# EAGLE schematic resistor-pull-up-down (EAGLE 9.5.2)
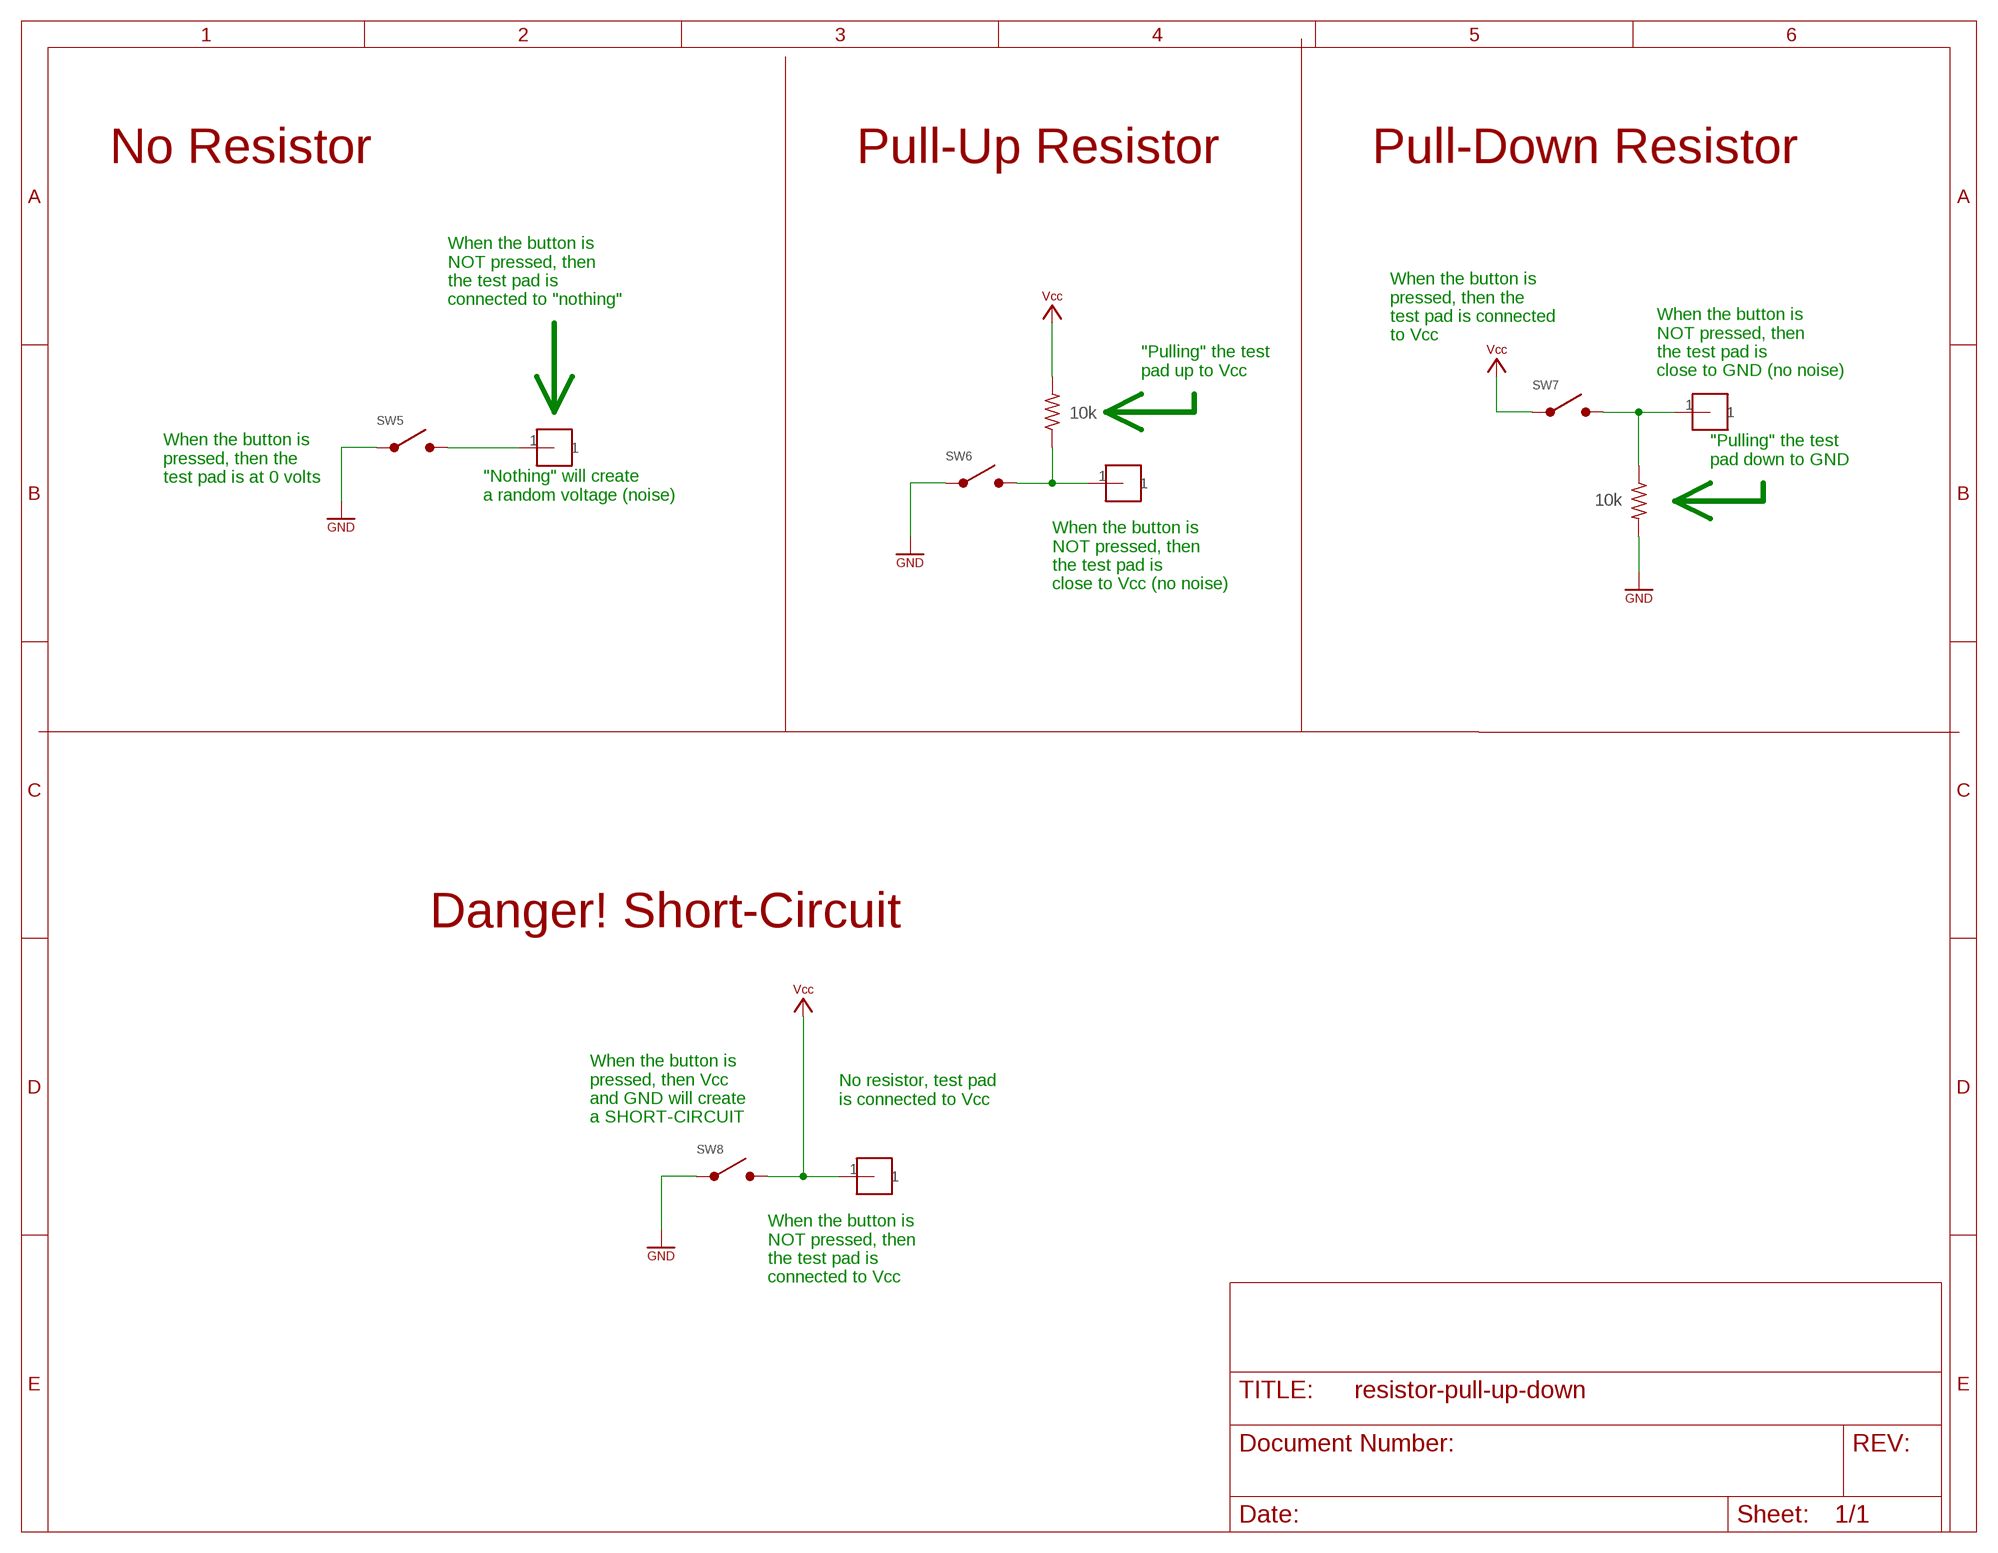
[diagram p0: schematic, sheet 1]

## Parts
R1  10k  R-US_R0603  [R0603]
R2  10k  R-US_R0603  [R0603]
SW5  SWITCH_BUTTON_SPST  [7914G-1-000E]
SW6  SWITCH_BUTTON_SPST  [7914G-1-000E]
SW7  SWITCH_BUTTON_SPST  [7914G-1-000E]
SW8  SWITCH_BUTTON_SPST  [7914G-1-000E]
U$1  HEADER-1-TESTPOINT  [TESTPOINT-1]
U$2  HEADER-1-TESTPOINT  [TESTPOINT-1]
U$3  HEADER-1-TESTPOINT  [TESTPOINT-1]
U$4  HEADER-1-TESTPOINT  [TESTPOINT-1]

## Nets
GND: R2.2 SW5.1A SW5.1B SW6.1A SW6.1B SW8.1A SW8.1B ; supply symbol labelled SYMBOL_GND
N$2: R1.1 SW6.2A SW6.2B U$2.1
N$3: SW5.2A SW5.2B U$1.1
N$5: R2.1 SW7.2A SW7.2B U$3.1
VCC: R1.2 SW7.1A SW7.1B SW8.2A SW8.2B U$4.1 ; supply symbol labelled SYMBOL_VCC

## Notes on the sheet
- No Resistor | Pull-Up Resistor | Pull-Down Resistor
- When the button is
  NOT pressed, then
  the test pad is
  connected to "nothing"
- When the button is
  pressed, then the
  test pad is connected
  to Vcc
- "Pulling" the test
  pad up to Vcc
- When the button is
  NOT pressed, then
  the test pad is
  close to GND (no noise)
- "Pulling" the test
  pad down to GND
- When the button is
  pressed, then the
  test pad is at 0 volts
- "Nothing" will create
  a random voltage (noise)
- When the button is
  NOT pressed, then
  the test pad is
  close to Vcc (no noise)
- Danger! Short-Circuit
- No resistor, test pad
  is connected to Vcc
- When the button is
  pressed, then Vcc
  and GND will create
  a SHORT-CIRCUIT
- When the button is
  NOT pressed, then
  the test pad is
  connected to Vcc

## Library data of the parts
R1 R2 = adafruit:R-US_: RESISTOR, American symbol
SW5-SW8 = homemade-hardware:SWITCH_BUTTON_SPST: 7914G-1-000E <https://www.digikey.com/product-detail/en/bourns-inc/7914G-1-000E/7914G-000EDKR-ND/741386>: Momentary Button; HEIGHT: 4.2; PN: 7914G-1-000E
U$1-U$4 = homemade-hardware:HEADER-1: M20-8890845 <https://www.digikey.com/products/en?keywords=952-3236-ND>: Horizontal Male SMD Headers M20-7910842R <https://www.digikey.com/product-detail/en/harwin-inc/M20-7910842R/952-3200-6-ND/6559341>: Horizontal Female SMD Headers